# Altium schematic sheet ArdUno_AADsm5-42b_sch.SchDoc
size 594 x 420 mm; Address1: МГТУ им. Н.Э. Баумана; Address2: Кафедра СМ5; Address3: Группа СМ5-42Б; Scale: 1:1; DocumentType: Схема электрическая принципиальная; FirstReferrence: АБВГ.123456.001
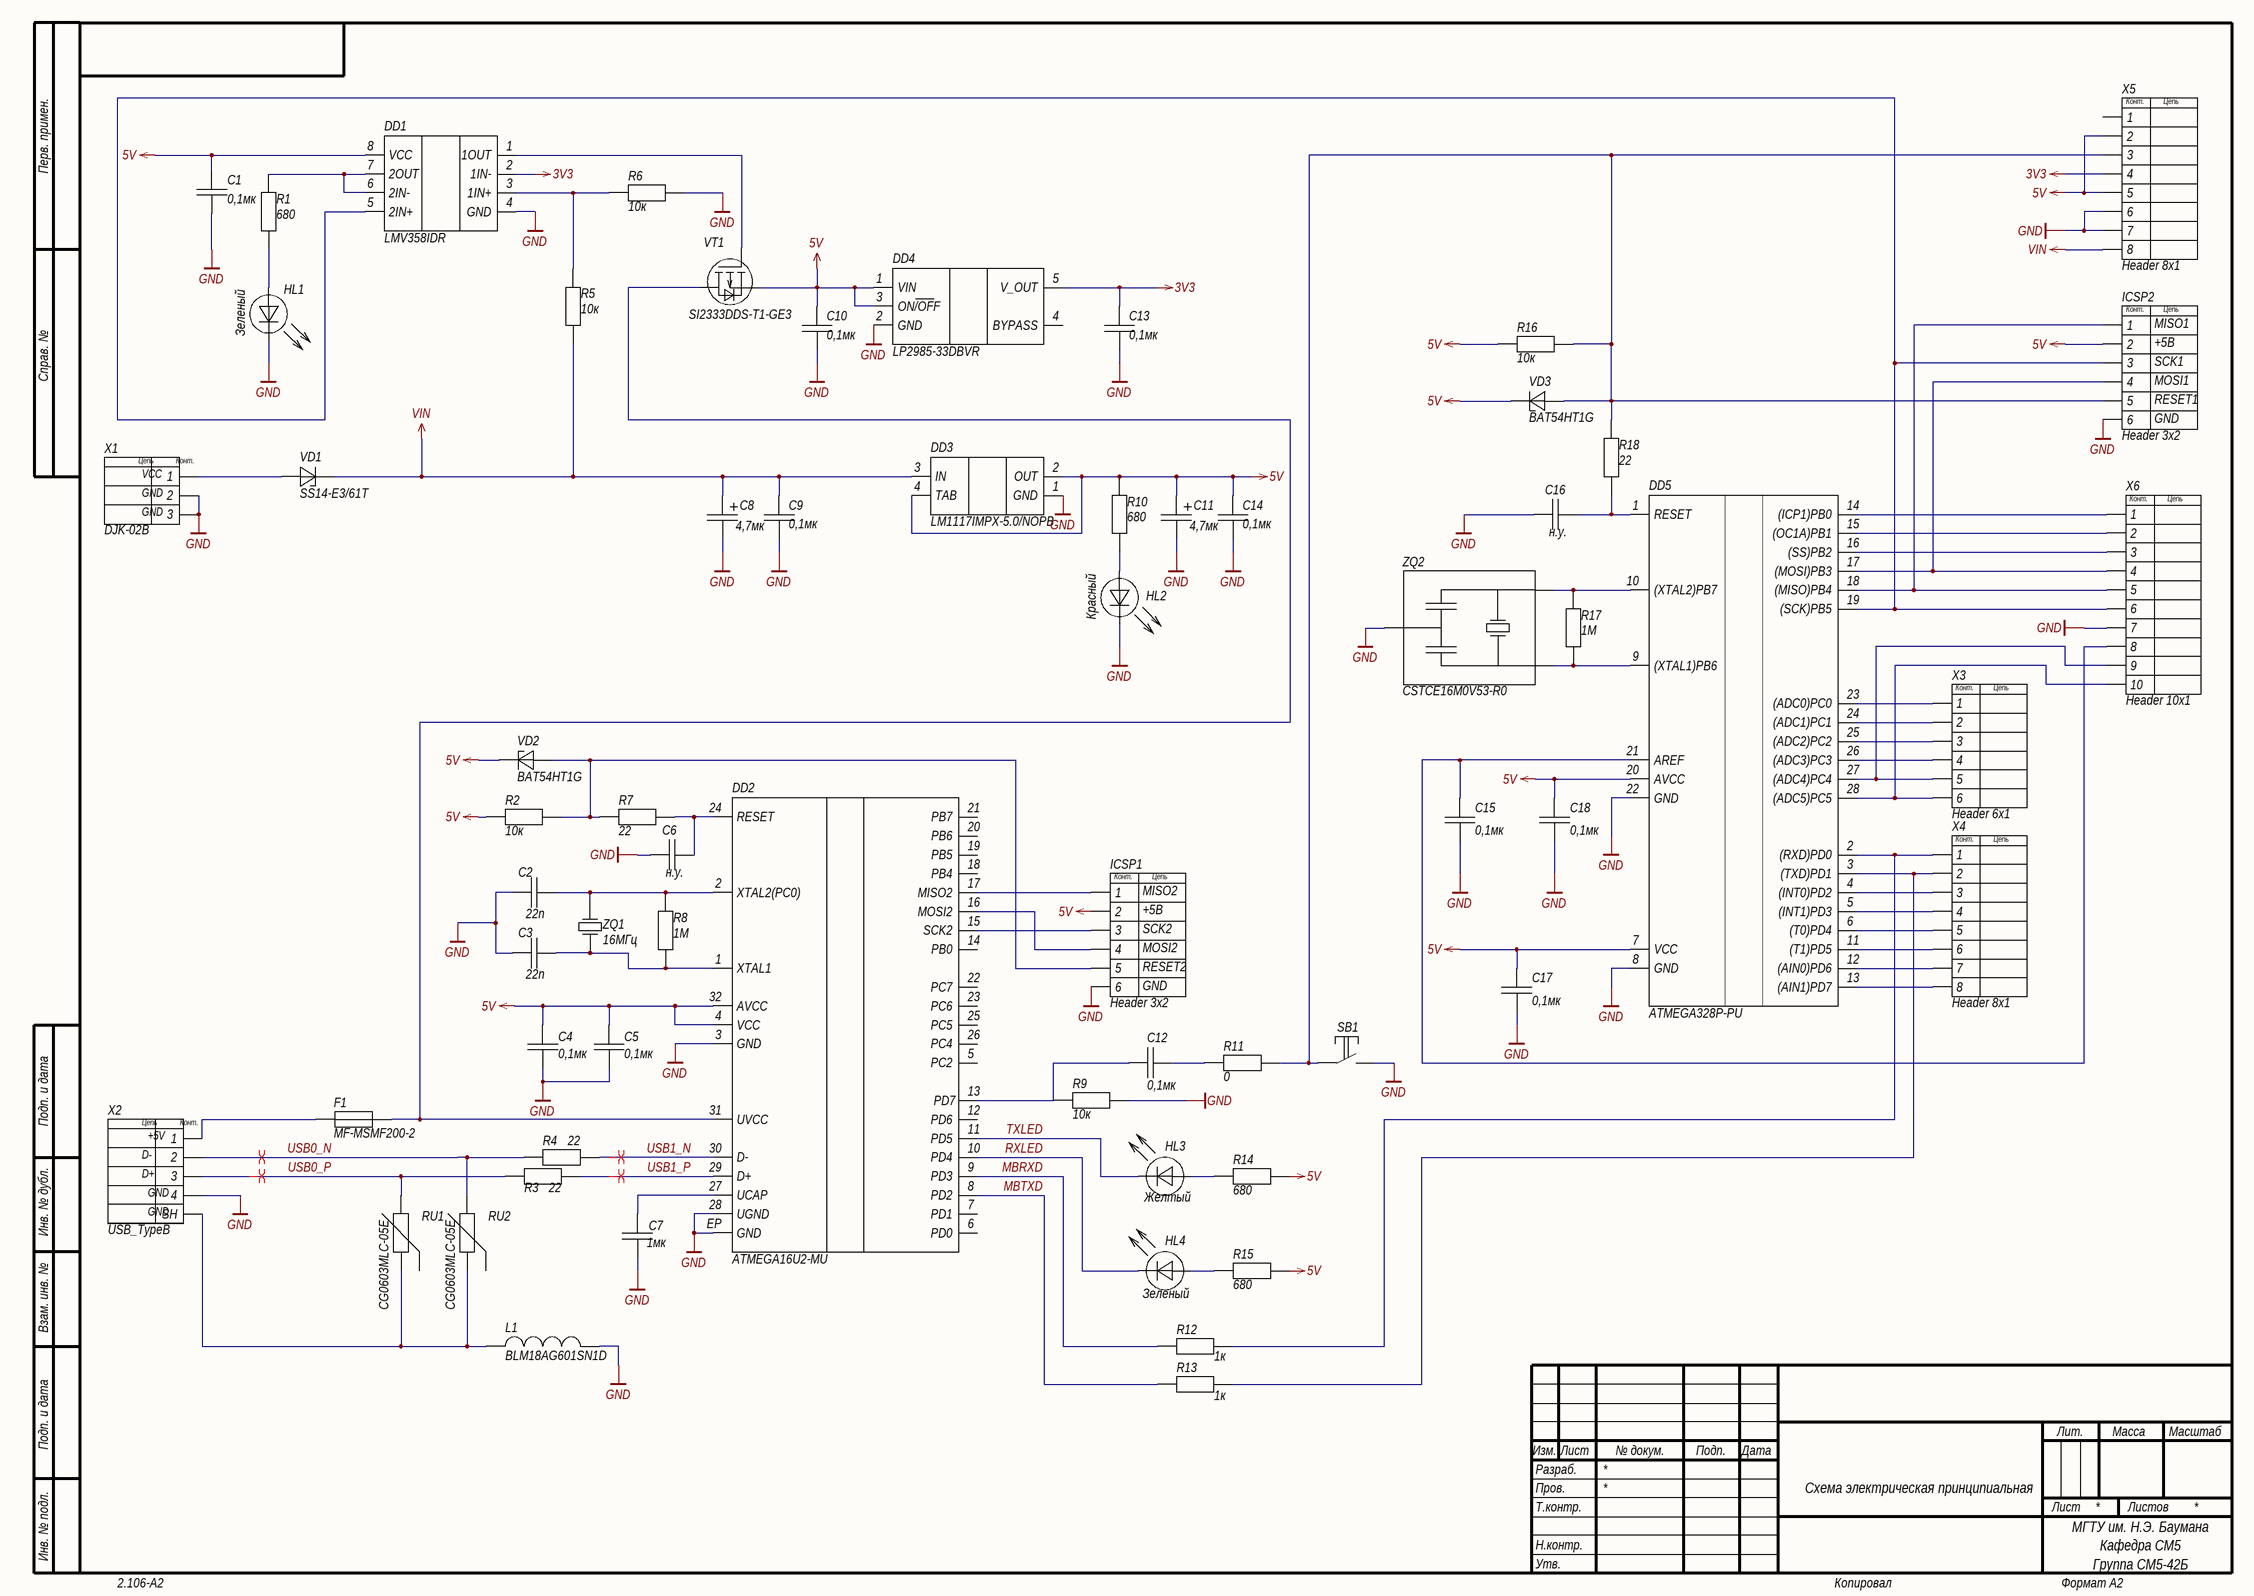
[diagram p0: ArdUno_AADsm5-42b_sch.SchDoc]

## Parts
C1  0,1мк  [0603_CAP]
C2  22n  [0603_CAP]
C3  22n  [0603_CAP]
C4  0,1мк  [0603_CAP]
C5  0,1мк  [0603_CAP]
C6  н.у.  [0603_CAP]
C7  1мк  [0603_CAP]
C8  4,7мк  [0607_ELECTR_CAP]
C9  0,1мк  [0603_CAP]
C10  0,1мк  [0603_CAP]
C11  4,7мк  [0607_ELECTR_CAP]
C12  0,1мк  [0603_CAP]
C13  0,1мк  [0603_CAP]
C14  0,1мк  [0603_CAP]
C15  0,1мк  [0603_CAP]
C16  н.у.  [0603_CAP]
C17  0,1мк  [0603_CAP]
C18  0,1мк  [0603_CAP]
DD1  LMV358IDR  [SOIC-8]
DD2  ATMEGA16U2-MU  [QFN32_0.5_5x5mm]
DD3  LM1117IMPX-5.0/NOPB  [SOT223-4]
DD4  LP2985-33DBVR  [SOT23-5]
DD5  ATMEGA328P-PU  [DIP28_2.54]
F1  MF-MSMF200-2  [MF-MSMF200]
HL1  Зеленый  [0603_LED_GREEN]
HL2  Красный  [0603_LED_RED]
HL3  Желтый  [0603_LED_YELLOW]
HL4  Зеленый  [0603_LED_GREEN]
ICSP1  Header 3x2  [HDR2X3]
ICSP2  Header 3x2  [HDR2X3]
L1  BLM18AG601SN1D  [0603_IND]
R1  680  [0603_RES]
R2  10к  [0603_RES]
R3  22  [0603_RES]
R4  22  [0603_RES]
R5  10к  [0603_RES]
R6  10к  [0603_RES]
R7  22  [0603_RES]
R8  1М  [0603_RES]
R9  10к  [0603_RES]
R10  680  [0603_RES]
R11  0  [0603_RES]
R12  1к  [0603_RES]
R13  1к  [0603_RES]
R14  680  [0603_RES]
R15  680  [0603_RES]
R16  10к  [0603_RES]
R17  1М  [0603_RES]
R18  22  [0603_RES]
RU1  CG0603MLC-05E  [0603_VAR]
RU2  CG0603MLC-05E  [0603_VAR]
SB1  2-1437565-7  [TACT_Switch]  (value not drawn)
VD1  SS14-E3/61T  [DO214AC(SMA)]
VD2  BAT54HT1G  [SOD-323]
VD3  BAT54HT1G  [SOD-323]
VT1  SI2333DDS-T1-GE3  [SOT-23]
X1  DJK-02B  [DJK-02B]
X2  USB_TypeB  [USB_typeB]
X3  Header 6x1  [PBS-6]
X4  Header 8x1  [PBS-8]
X5  Header 8x1  [PBS-8]
X6  Header 10x1  [PBS-10]
ZQ1  16МГц  [HC-49S]
ZQ2  CSTCE16M0V53-R0  [CSTCE16M0V53-R0]

## Nets
3V3: C13.2 DD1.2(1IN-) DD4.5(V_OUT) X5.4
5V: C1.2 C4.2 C5.2 C10.2 C11.1 C14.2 C17.2 C18.2 DD1.8(VCC) DD2.4(VCC) DD2.32(AVCC) DD3.2(OUT) DD3.4(TAB) DD4.1(VIN) DD4.3(ON/OFF) DD5.7(VCC) DD5.20(AVCC) ICSP1.2 ICSP2.2 R2.1 R10.2 R14.2 R15.2 R16.1 VD2.K VD3.K VT1.1 X5.2 X5.5
GND: C1.1 C2.2 C3.2 C4.1 C5.1 C6.2 C7.1 C8.2 C9.1 C10.1 C11.2 C13.1 C14.1 C15.1 C16.2 C17.1 C18.1 DD1.4(GND) DD2.3(GND) DD2.28(UGND) DD2.EP(GND) DD3.1(GND) DD4.2(GND) DD5.8(GND) DD5.22(GND) HL1.K HL2.K ICSP1.6 ICSP2.6 L1.2 R6.2 R9.2 SB1.2 X1.2 X1.3 X2.4 X5.6 X5.7 X6.7 ZQ2.2
VIN: C8.1 C9.2 DD3.3(IN) R5.1 VD1.K X5.8
MBRXD: DD2.9(PD3) R12.1
MBTXD: DD2.8(PD2) R13.1
RXLED: DD2.10(PD4) HL4.K
TXLED: DD2.11(PD5) HL3.K
USB0_N: R4.1 RU2.2 X2.2
USB0_P: R3.1 RU1.2 X2.3
USB1_N: DD2.30(D-) R4.2
USB1_P: DD2.29(D+) R3.2
NetC2_1: C2.1 DD2.2(XTAL2(PC0)) R8.2 ZQ1.2
NetC3_1: C3.1 DD2.1(XTAL1) R8.1 ZQ1.1
NetC6_1: C6.1 DD2.24(RESET) R7.2
NetC7_2: C7.2 DD2.27(UCAP)
NetC12_1: C12.1 R11.1
NetC12_2: C12.2 DD2.13(PD7) R9.1
NetC15_2: C15.2 DD5.21(AREF) X6.8
NetC16_1: C16.1 DD5.1(RESET) R18.1
NetDD1_1: DD1.1(1OUT) VT1.3
NetDD1_3: DD1.3(1IN+) R5.2 R6.1
NetDD1_5: DD1.5(2IN+) DD5.19((SCK)PB5) ICSP2.3 X6.6
NetDD1_6: DD1.6(2IN-) DD1.7(2OUT) R1.2
NetDD2_15: DD2.15(SCK2) ICSP1.3
NetDD2_16: DD2.16(MOSI2) ICSP1.4
NetDD2_17: DD2.17(MISO2) ICSP1.1
NetDD2_31: DD2.31(UVCC) F1.2 VT1.2
NetDD5_2: DD5.2((RXD)PD0) R12.2 X4.1
NetDD5_3: DD5.3((TXD)PD1) R13.2 X4.2
NetDD5_4: DD5.4((INT0)PD2) X4.3
NetDD5_5: DD5.5((INT1)PD3) X4.4
NetDD5_6: DD5.6((T0)PD4) X4.5
NetDD5_9: DD5.9((XTAL1)PB6) R17.1 ZQ2.3
NetDD5_10: DD5.10((XTAL2)PB7) R17.2 ZQ2.1
NetDD5_11: DD5.11((T1)PD5) X4.6
NetDD5_12: DD5.12((AIN0)PD6) X4.7
NetDD5_13: DD5.13((AIN1)PD7) X4.8
NetDD5_14: DD5.14((ICP1)PB0) X6.1
NetDD5_15: DD5.15((OC1A)PB1) X6.2
NetDD5_16: DD5.16((SS)PB2) X6.3
NetDD5_17: DD5.17((MOSI)PB3) ICSP2.4 X6.4
NetDD5_18: DD5.18((MISO)PB4) ICSP2.1 X6.5
NetDD5_23: DD5.23((ADC0)PC0) X3.1
NetDD5_24: DD5.24((ADC1)PC1) X3.2
NetDD5_25: DD5.25((ADC2)PC2) X3.3
NetDD5_26: DD5.26((ADC3)PC3) X3.4
NetDD5_27: DD5.27((ADC4)PC4) X3.5 X6.9
NetDD5_28: DD5.28((ADC5)PC5) X3.6 X6.10
NetF1_1: F1.1 X2.1
NetHL1_A: HL1.A R1.1
NetHL2_A: HL2.A R10.1
NetHL3_A: HL3.A R14.1
NetHL4_A: HL4.A R15.1
NetICSP1_5: ICSP1.5 R2.2 R7.1 VD2.A
NetICSP2_5: ICSP2.5 R11.2 R16.2 R18.2 SB1.1 VD3.A X5.3
NetL1_1: L1.1 RU1.1 RU2.1 X2.0(SH)
NetVD1_A: VD1.A X1.1

Not connected (* = marked no-connect by the designer): DD2 5(PC2) 6(PD0) 7(PD1) 12(PD6) 14(PB0) 18(PB4) 19(PB5) 20(PB6) 21(PB7) 22(PC7) 23(PC6) 25(PC5) 26(PC4); DD4 4(BYPASS); X5 1

## Layout directives
differential pair: USB0_N, USB0_P, USB1_N, USB1_P

## Notes on the sheet
- (near ICSP2) MISO1
- (near ICSP2) +5B
- (near ICSP2) SCK1
- (near ICSP2) MOSI1
- (near ICSP2) RESET1
- (near ICSP2) GND
- (near ICSP1) MISO2
- (near ICSP1) +5B
- (near ICSP1) SCK2
- (near ICSP1) MOSI2
- (near ICSP1) RESET2
- (near ICSP1) GND
- Перв. примен.
- Справ. №
- Подп. и дата
- Инв. № дубл.
- Взам. инв. №
- Разраб.
- Изм.
- Лист
- № докум.
- Подп.
- Дата
- Лит.
- Масса
- Масштаб
- Пров.
- Т.контр.
- Листов
- Инв. № подл.
- Утв.
- Н.контр.
- 2.106-A2
- Копировал
- Формат А2
- (in symbol DJK-02B_PWR_CON) Цепь; Конт.; VCC; GND
- (in symbol Header 3x2) Конт.; Цепь
- (in symbol Header 6x1) Конт.; Цепь
- (in symbol Header 8x1) Конт.; Цепь
- (in symbol Header 10x1) Конт.; Цепь
- (in symbol USB_TypeB) Цепь; Конт.; +5V; D-; D+; GND

## Library data of the parts
C1 C4 C5 C7 C9 C10 C12-C15 C17 C18 = Capacitor: Tolerance: 10%; ValueType: Конденсатор; Dielectric: X7R; Package: 0603; ValueDescription: =Value+'Ф '+Voltage+' '+Dielectric+' '+Tolerance+' '+Package+' SMD'
  C1 C4 C5 C9 C10 C12-C15 C17 C18: Value: 0,1мк
  C7: Value: 1мк
C2 C3 = Capacitor: Tolerance: 5%; ValueType: Конденсатор; Dielectric: NP0; Package: 0603; ValueDescription: =Value+'Ф '+Voltage+' '+Dielectric+' '+Tolerance+' '+Package+' SMD'; Value: 22n
C6 C16 = Capacitor: ValueType: Конденсатор; Примечание: Не устанавливать; Package: 0603; ValueDescription: н.у.; Value: н.у.
C8 C11 = Capacitor_pol: Tolerance: 20%; ValueType: Конденсатор; Package: 0607; Value: 4,7мк; ValueDescription: =Value+'Ф '+Voltage+' '+Dielectric+' '+Tolerance+' '+Package+' SMD'
DD1 = LMV358IDR: ValueManufacturer: Texas Instruments; ValueDescription: Операционный усилитель; Package: SOIC-8; ValueManufacturerPartNumber: LMV358IDR; ValueType: Операционный усилитель
DD2 = ATMEGA16U2-MU: ValueManufacturer: ATMEGA; ValueType: Микроконтроллер; ValueManufacturerPartNumber: ATMEGA16U2-MU; Package: QFN32_0.5_5x5mm; ValueDescription: Микроконтроллер
DD3 = LM1117IMPX-5.0/NOPB: ValueManufacturer: Texas Instruments; ValueDescription: Линейный стабилизатор напряжения; Package: SOT-223; ValueManufacturerPartNumber: LM1117IMPX-5.0; ValueType: Линейный стабилизатор напряжения
DD4 = LP2985-33DBVR: ValueManufacturer: Texas Instruments; ValueDescription: Линейный стабилизатор напряжения; Package: SOT23-5; ValueManufacturerPartNumber: LP2985-33DBVR; ValueType: Линейный стабилизатор напряжения
DD5 = ATMEGA328P-PU: ValueManufacturer: ATMEGA; ValueType: Микроконтроллер; ValueManufacturerPartNumber: ATMEGA328P-PU; ValueDescription: Микроконтроллер; Package: DIP28
F1 = Fuse: ValueDescription: Предохранитель; ValueManufacturerPartNumber: MF-MSMF200-2; ValueType: Предохранитель
HL1 HL4 = Led_green: ValueManufacturer: Foryard; ValueManufacturerPartNumber: FYLS-0603UGC; Temp: -40C...+85C; ValueDescription: Светодиод; Package: 0603; Value: Зеленый; ValueType: Светодиод
HL2 = Led_red: ValueManufacturer: Foryard; ValueManufacturerPartNumber: FYLS-0603URC; Temp: -40C...+85C; ValueDescription: Светодиод; Package: 0603; Value: Красный; ValueType: Светодиод
HL3 = Led_yellow: ValueManufacturer: Foryard; ValueManufacturerPartNumber: FYLS-0603UYC; Temp: -40C...+85C; ValueDescription: Светодиод; Package: 0603; Value: Желтый; ValueType: Светодиод
ICSP1 ICSP2 = Header 3x2: ValueManufacturerPartNumber: PLD-6; ValueDescription: Разъем штыревой 2,54 мм  Разъем штыревой 2,54 мм; ValueType: Разъем штыревой 2,54 мм; Package: HDR2X3
L1 = Inductor: ValueDescription: Индуктивность; ValueManufacturerPartNumber: BLM18AG601SN1D; ValueType: Индуктивность
R1 R10 = Resistor: Tolerance: 5%; Power: 0,1 Вт; ValueDescription: 680Ом 5% 0603 SMD; ValueType: Резистор; Package: 0603; Value: 680
R2 R5 R6 R9 R16 = Resistor: Tolerance: 5%; ValueDescription: 10кОм 5% 0603 SMD; ValueType: Резистор; Package: 0603; Value: 10к
R3 R4 R7 R18 = Resistor: Tolerance: 1%; ValueDescription: 22Ом 1% 0603 SMD; ValueType: Резистор; Package: 0603; Value: 22
R8 R17 = Resistor: Tolerance: 5%; ValueDescription: 1МОм 5% 0603 SMD; ValueType: Резистор; Package: 0603; Value: 1М
R11 = Resistor: Tolerance: 5%; ValueDescription: 0Ом 5% 0603 SMD; ValueType: Резистор; Package: 0603; Value: 0
R12 R13 = Resistor: Tolerance: 1%; ValueDescription: 1кОм 1% 0603 SMD; ValueType: Резистор; Package: 0603; Value: 1к
R14 R15 = Resistor: Tolerance: 5%; ValueDescription: 680Ом 5% 0603 SMD; ValueType: Резистор; Package: 0603; Value: 680
RU1 RU2 = Varistor: ValueDescription: Варистор; ValueManufacturerPartNumber: CG0603MLC-05E; ValueType: Варистор
SB1 = Button: ValueManufacturer: Te Connectivity; ValueDescription: Кнопка тактовая; ValueManufacturerPartNumber: 2-1437565-7; ValueType: Кнопка тактовая
VD1 = DiodeSch_SS14-E3/61T: ValueManufacturer: Vishay; ValueDescription: Диод Шоттки; ValueManufacturerPartNumber: SS14-E3/61T; ValueType: Диод Шоттки
VD2 VD3 = DiodeSch_BAT54HT1G: ValueManufacturer: On Semiconductor; ValueDescription: Диод Шоттки; ValueManufacturerPartNumber: BAT54HT1G; ValueType: Диод Шоттки
VT1 = Si2333DDS P_type: ValueManufacturer: Vishay; ValueDescription: Полевой транзистор; ValueType: MOSFET; Package: SOT-23; ValueManufacturerPartNumber: SI2333DDS-T1-GE3
X1 = DJK-02B_PWR_CON: ValueManufacturer: KLS; ValueDescription: Разъем питания; ValueManufacturerPartNumber: DJK-02B; ValueType: Разъем питания
X2 = USB_TypeB: ValueManufacturer: Te Connectivity; ValueManufacturerPartNumber: 292304-1; ValueDescription: Разъем; ValueType: USB разъем тип B
X3 = Header 6x1: ValueDescription: Разъем; Package: PBS-6; ValueManufacturerPartNumber: PBS-6; ValueType: Разъем
X4 X5 = Header 8x1: ValueDescription: Разъем; Package: PBS-8; ValueManufacturerPartNumber: PBS-8; ValueType: Разъем
X6 = Header 10x1: ValueDescription: Разъем; Package: PBS-10; ValueManufacturerPartNumber: PBS-10; ValueType: Разъем
ZQ1 = Quartz: ValueManufacturerPartNumber: KX-KT 16.0MHz; ValueDescription: Кварцевый резонатор; ValueType: Кварцевый резонатор; Value: 16МГц
ZQ2 = Quartz_CSTCE16M0V53-R0: ValueManufacturer: Murata; Temp: -40C...+85C; ValueDescription: Керамический резонатор; Tolerance: 0,5%; Value: 16 МГц; Package: HC-49S; ValueManufacturerPartNumber: CSTCE16M0V53-R0; ValueType: Керамический резонатор